# Altium schematic sheet Amoled.SchDoc: Mạch Amoled RP2040
size 420 x 297 mm; Author: Phuoc Do Tan; SheetNumber: 1; SheetTotal: 1
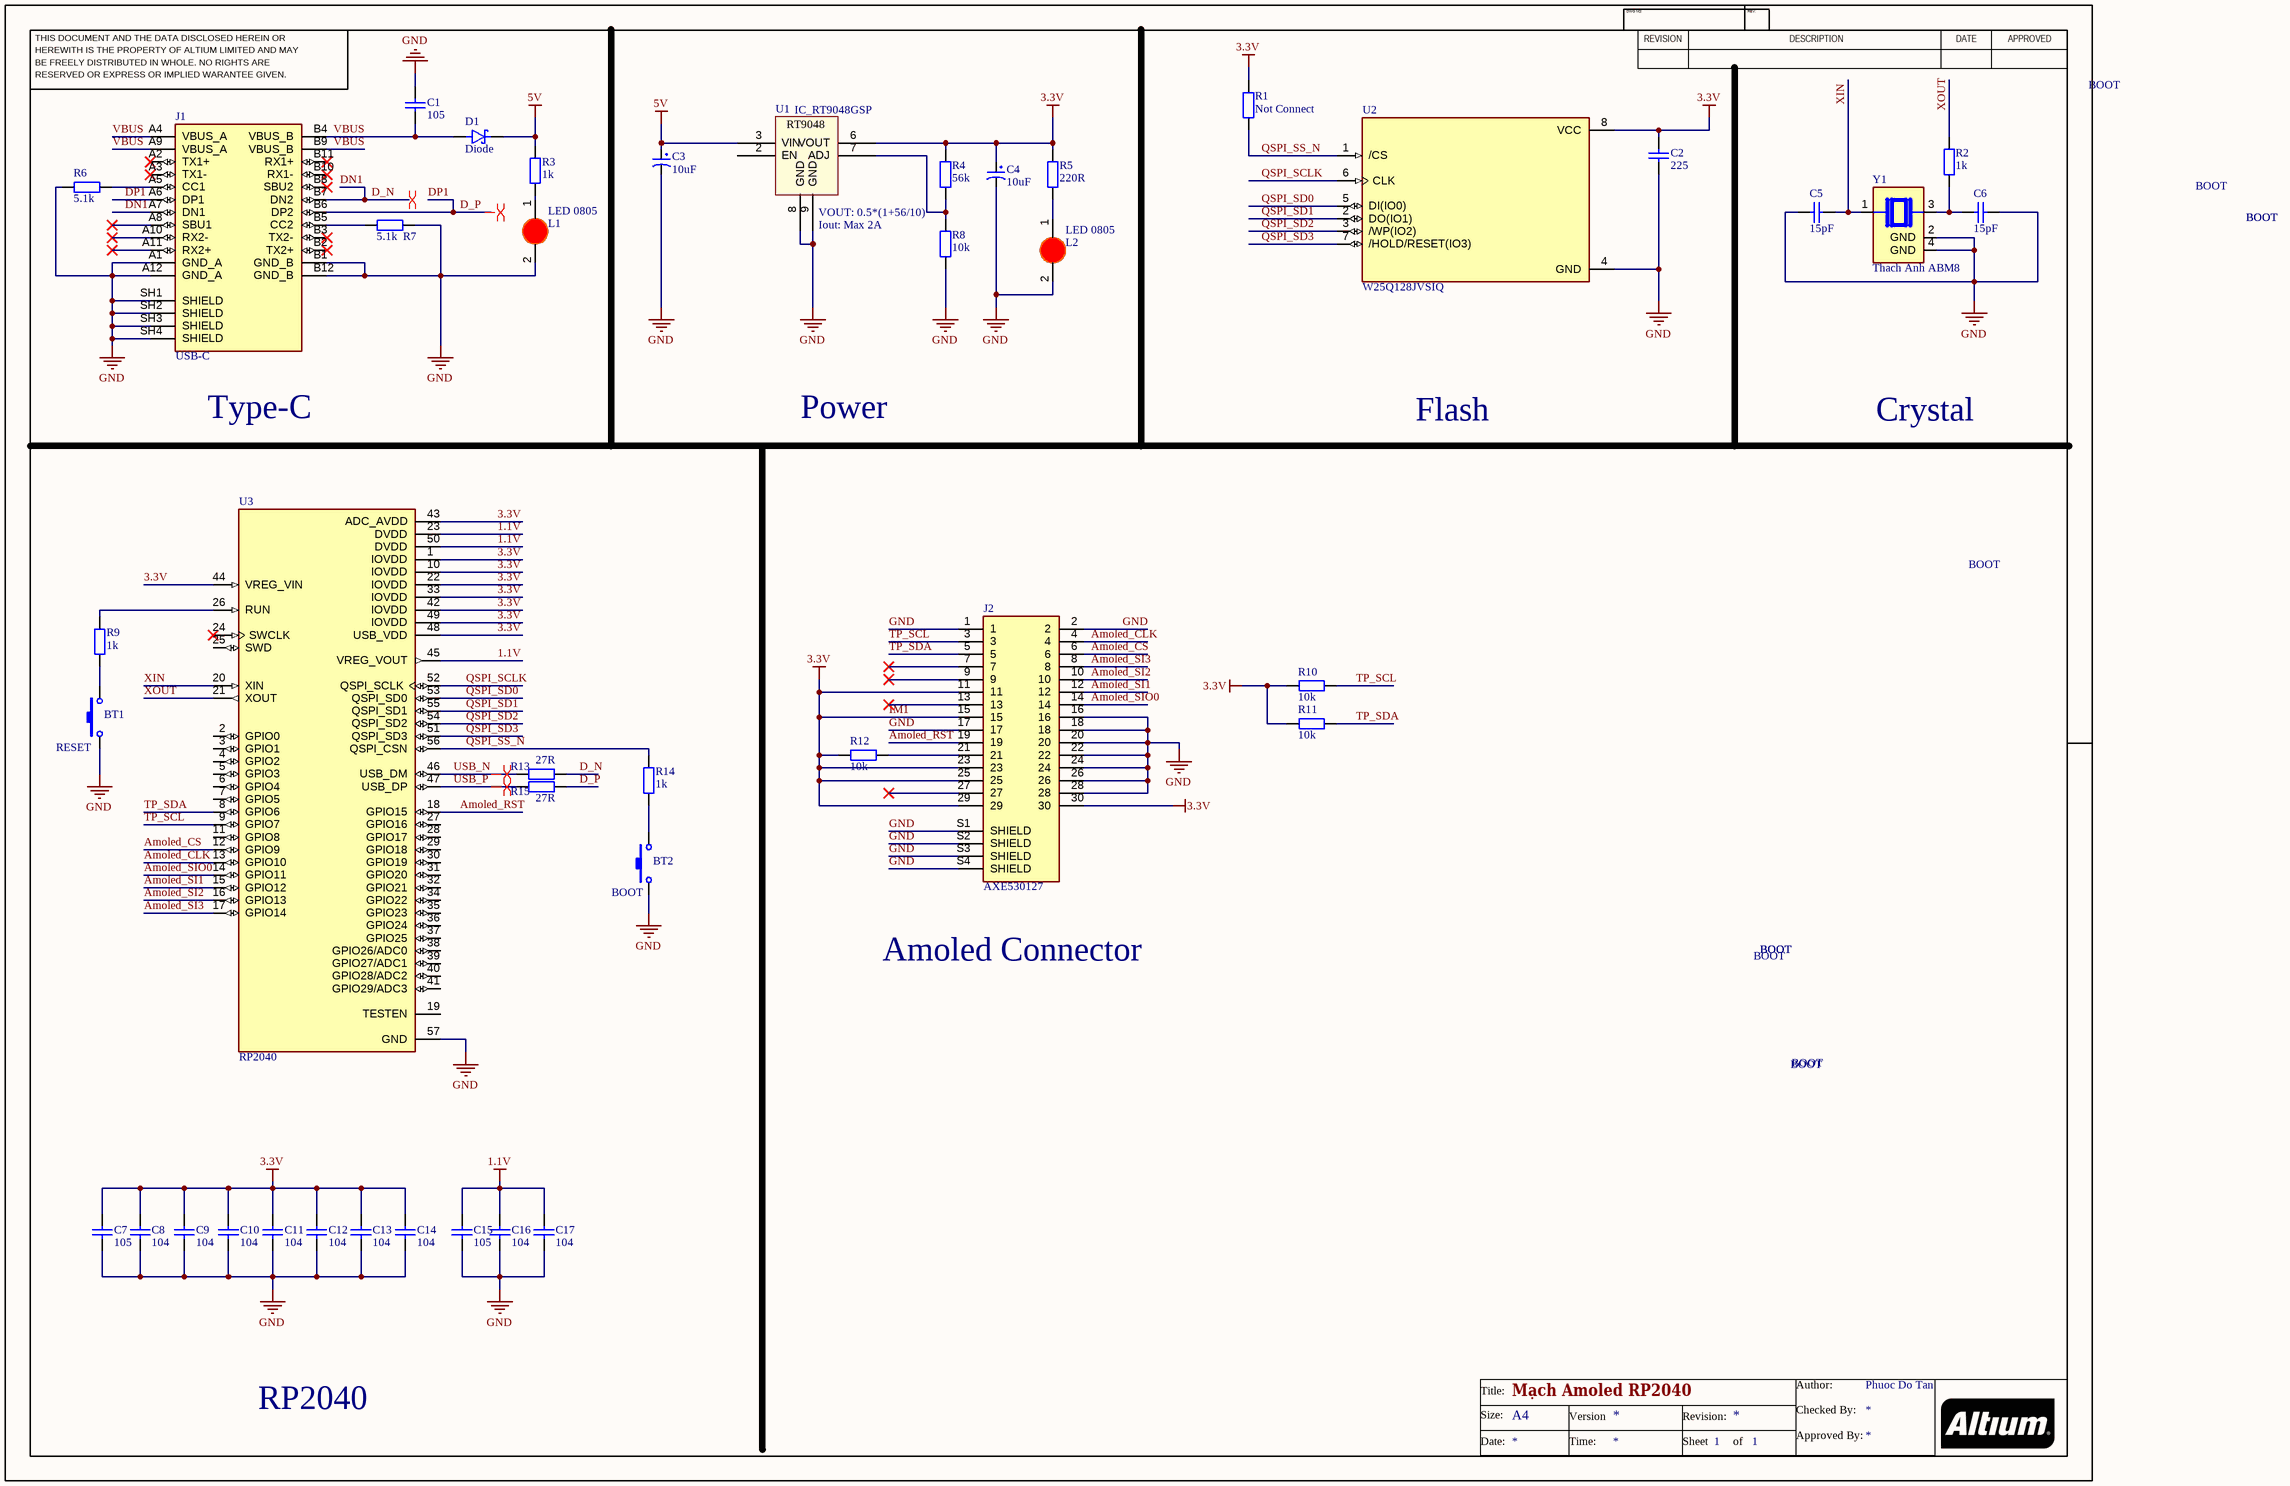
[diagram p0: Amoled.SchDoc]

## Parts
BT1  Nut Nhan 2 Chan SMD 3x6x2.5  [Nut Nhan 2 Chan SMD 3x6x2.5]  (value not drawn)
BT2  Nut Nhan 2 Chan SMD 3x6x2.5  [Nut Nhan 2 Chan SMD 3x6x2.5]  (value not drawn)
C1  105  [tu 0805]
C2  225  [tu 0805]
C3  10uF  [tu tantalum smd3216]
C4  10uF  [tu tantalum smd3216]
C5  15pF  [tu 0805]
C6  15pF  [tu 0805]
C7  105  [tu 0805]
C8  104  [tu 0805]
C9  104  [tu 0805]
C10  104  [tu 0805]
C11  104  [tu 0805]
C12  104  [tu 0805]
C13  104  [tu 0805]
C14  104  [tu 0805]
C15  105  [tu 0805]
C16  104  [tu 0805]
C17  104  [tu 0805]
D1  Diode  [SODFL3619X98N]
J1  USB-C  [USB-C]
J2  AXE530127  [PANASONIC_AXE530127]
L1  LED 0805  [LED-0805-Red]
L2  LED 0805  [LED-0805-Red]
R1  Not Connect  [tro smd 0805]
R2  1k  [tro smd 0805]
R3  1k  [tro smd 0805]
R4  56k  [tro smd 0805]
R5  220R  [tro smd 0805]
R6  5.1k  [tro smd 0805]
R7  5.1k  [tro smd 0805]
R8  10k  [tro smd 0805]
R9  1k  [tro smd 0805]
R10  10k  [tro smd 0805]
R11  10k  [tro smd 0805]
R12  10k  [tro smd 0805]
R13  27R  [tro smd 0805]
R14  1k  [tro smd 0805]
R15  27R  [tro smd 0805]
U1  IC_RT9048GSP  [SOP-8(Exposed Pad)]
U2  W25Q128JVSIQ  [SOIC127P790X216-8N]
U3  RP2040  [RP2040]
Y1  Thach Anh ABM8  [XTAL_ABM8-272-T3]

## Nets
1.1V: C15.1 C16.1 C17.1 U3.23(DVDD) U3.45(VREG_VOUT) U3.50(DVDD)
3.3V: C2.1 C4.1 C7.1 C8.1 C9.1 C10.1 C11.1 C12.1 C13.1 C14.1 J2.11 J2.15 J2.23 J2.25 J2.29 J2.30 R1.2 R4.2 R5.2 R10.1 R11.1 R12.1 U1.6(VOUT) U2.8(VCC) U3.1(IOVDD) U3.10(IOVDD) U3.22(IOVDD) U3.33(IOVDD) U3.42(IOVDD) U3.43(ADC_AVDD) U3.44(VREG_VIN) U3.48(USB_VDD) U3.49(IOVDD)  [also labelled IM1]
5V: C3.1 D1.K R3.1 U1.3(VIN)
GND: BT1.1 BT2.1 C1.1 C2.2 C3.2 C4.2 C5.2 C6.1 C7.2 C8.2 C9.2 C10.2 C11.2 C12.2 C13.2 C14.2 C15.2 C16.2 C17.2 J1.A1(GND_A) J1.A12(GND_A) J1.B1(GND_B) J1.B12(GND_B) J1.SH1(SHIELD) J1.SH2(SHIELD) J1.SH3(SHIELD) J1.SH4(SHIELD) J2.1 J2.2 J2.16 J2.17 J2.18 J2.20 J2.22 J2.24 J2.26 J2.28 J2.S1(SHIELD) J2.S2(SHIELD) J2.S3(SHIELD) J2.S4(SHIELD) L1.2(K) L2.2(K) R6.1 R7.2 R8.2 U1.8(GND) U1.9(GND) U2.4(GND) U3.57(GND) Y1.2(GND) Y1.4(GND)
Amoled_CLK: J2.4 U3.13(GPIO10)
Amoled_CS: J2.6 U3.12(GPIO9)
Amoled_RST: J2.19 U3.18(GPIO15)
Amoled_SI1: J2.12 U3.15(GPIO12)
Amoled_SI2: J2.10 U3.16(GPIO13)
Amoled_SI3: J2.8 U3.17(GPIO14)
Amoled_SIO0: J2.14 U3.14(GPIO11)
D_N: J1.A7(DN1) J1.B7(DN2) R13.2  [also labelled DN1]
D_P: J1.A6(DP1) J1.B6(DP2) R15.2  [also labelled DP1]
QSPI_SCLK: U2.6(CLK) U3.52(QSPI_SCLK)
QSPI_SD0: U2.5(DI(IO0)) U3.53(QSPI_SD0)
QSPI_SD1: U2.2(DO(IO1)) U3.55(QSPI_SD1)
QSPI_SD2: U2.3(/WP(IO2)) U3.54(QSPI_SD2)
QSPI_SD3: U2.7(/HOLD/RESET(IO3)) U3.51(QSPI_SD3)
QSPI_SS_N: R1.1 R14.1 U2.1(/CS) U3.56(QSPI_CSN)
TP_SCL: J2.3 R10.2 U3.9(GPIO7)
TP_SDA: J2.5 R11.2 U3.8(GPIO6)
USB_N: R13.1 U3.46(USB_DM)
USB_P: R15.1 U3.47(USB_DP)
VBUS: C1.2 D1.A J1.A4(VBUS_A) J1.A9(VBUS_A) J1.B4(VBUS_B) J1.B9(VBUS_B)
XIN: C5.1 U3.20(XIN) Y1.1
XOUT: R2.1 U3.21(XOUT)
NetBT1_2: BT1.2 R9.2
NetBT2_2: BT2.2 R14.2
NetC6_2: C6.2 R2.2 Y1.3
NetJ1_A5: J1.A5(CC1) R6.2
NetJ1_B5: J1.B5(CC2) R7.1
NetJ2_21: J2.21 R12.2
NetL1_1: L1.1(A) R3.2
NetL2_1: L2.1(A) R5.1
NetR4_1: R4.1 R8.1 U1.7(ADJ)
NetR9_1: R9.1 U3.26(RUN)

Not connected (* = marked no-connect by the designer): J1 A2(TX1+)* A3(TX1-)* A8(SBU1)* A10(RX2-)* A11(RX2+)* B2(TX2+)* B3(TX2-)* B8(SBU2)* B10(RX1-)* B11(RX1+)*; J2 7* 9* 13* 27*; U1 2(EN); U3 2(GPIO0) 3(GPIO1) 4(GPIO2) 5(GPIO3) 6(GPIO4) 7(GPIO5) 11(GPIO8) 19(TESTEN) 24(SWCLK)* 25(SWD) 27(GPIO16) 28(GPIO17) 29(GPIO18) 30(GPIO19) 31(GPIO20) 32(GPIO21) 34(GPIO22) 35(GPIO23) 36(GPIO24) 37(GPIO25) 38(GPIO26/ADC0) 39(GPIO27/ADC1) 40(GPIO28/ADC2) 41(GPIO29/ADC3)

## Layout directives
differential pair: D_N, D_P, USB_N, USB_P

## Notes on the sheet
- BOOT
- VOUT: 0.5*(1+56/10)
- (near U1) Iout: Max 2A
- Type-C
- Power
- Flash
- Crystal
- (near BT1) RESET
- (near BT2) BOOT
- Amoled Connector
- RP2040
- THIS DOCUMENT AND THE DATA DISCLOSED HEREIN OR
- HEREWITH IS THE PROPERTY OF ALTIUM LIMITED AND MAY
- DWG NO:
- REVISION
- REV:
- DESCRIPTION
- DATE
- APPROVED
- BE FREELY DISTRIBUTED IN WHOLE. NO RIGHTS ARE
- RESERVED OR EXPRESS OR IMPLIED WARANTEE GIVEN.
- Title:
- Size:
- Date:
- A4
- Version
- Time:
- Revision:
- Sheet
- of
- Checked By:
- Author:
- Approved By:
- (in symbol IC_RT9048GSP) RT9048

## Library data of the parts
BT1 BT2 = Nut Nhan 2 Chan SMD 3x6x2.5: Ma_Hang: MH001036; Ten: Nút Nhấn 2 Chân 3x6x2.5MM SMD
C1 C7 C15 = Tu 0805 105 50V 10%: Dán; Don_Vi: Con; So_Chan: 2; Ten_Linh_Kien: Tụ 0805 105-1uF 10% 50V; Ma_Hang: MH004552; Chung_Loai: Dán; Kieu_Chan: *
C2 = Tu 0805 225 25V 10%: Dán; Don_Vi: Con; So_Chan: 2; Ten_Linh_Kien: Tụ 0805 225-2.2uF 25V 10%; Ma_Hang: MH007483; Chung_Loai: Dán; Kieu_Chan: *
C3 C4 = Tu tantalum 10uF 16V SMD3216: Dán; Don_Vi: Con; So_Chan: 2; Ten_Linh_Kien: Tụ tantalum 106C-10uF 16V SMD3216; Ma_Hang: MH001954; Chung_Loai: Dán; Kieu_Chan: *
C5 C6 = Tu 0805 15pF 50V 10%: Dán; Don_Vi: Con; So_Chan: 2; Ten_Linh_Kien: Tụ 0805 15P 10% 50V; Ma_Hang: MH004556; Chung_Loai: Dán; Kieu_Chan: *
C8-C14 C16 C17 = Tu 0805 104 50V 10%: Dán; Don_Vi: Con; So_Chan: 2; Ten_Linh_Kien: Tụ 0805 104-100nF 10% 50V; Ma_Hang: MH004551; Chung_Loai: Dán; Kieu_Chan: *
D1 = Diode-MBR230LSFT1G: Diode Schottky 30 V 2A Surface Mount SOD-123FL; MF: ON Semiconductor; SnapEDA_Link: https://www.snapeda.com/parts/MBR230LSFT1G/Onsemi/view-part/?ref=snap; Package: SOD-123FL-2 ON Semiconductor; MP: MBR230LSFT1G; Check_prices: https://www.snapeda.com/parts/MBR230LSFT1G/Onsemi/view-part/?ref=eda
J1 = USB-C: Part Number: TE2345986-1; MP: 2345986-1; Package: None; Price: None; Value: *; Availability: Unavailable
J2 = AXE530127: 30 Position Connector Socket, Center Strip Contacts Surface Mount Gold; MF: Panasonic Electric Works; Purchase-URL: https://pricing.snapeda.com/search/part/AXE530127/?ref=eda; Package: None; MP: AXE530127; Value: *; SnapEDA_Link: https://www.snapeda.com/parts/AXE530127/Panasonic/view-part/?ref=snap; Availability: In Stock; Price: None; Check_prices: https://www.snapeda.com/parts/AXE530127/Panasonic/view-part/?ref=eda
L1 L2 = LED 0805 Do: Dán; Don_Vi: Con; Ma_Hang: MH000897; Ten_Linh_Kien: LED 0805 Màu Đỏ (Red); Ghi_Chu: *; Kieu_Chan: *; Chung_Loai: Dán
R1 = Tro 0805 5% 0R: Dán; Don_Vi: Con; So_Chan: 2; Ten_Linh_Kien: Trở 0805 5% 0R; Ma_Hang: MH005230; Chung_Loai: Dán; Kieu_Chan: *
R2 R3 R9 R14 = Tro 0805 5% 1k: Dán; Don_Vi: Con; So_Chan: 2; Ten_Linh_Kien: Trở 0805 5% 1k; Ma_Hang: MH005234; Chung_Loai: Dán; Kieu_Chan: *
R4 = Tro 0805 1% 510k: Dán; Don_Vi: Con; So_Chan: 2; Ten_Linh_Kien: Trở 0805 1% 56k; Ma_Hang: MH005486; Chung_Loai: Dán; Kieu_Chan: *
R5 = Tro 0805 5% 220R: Dán; Don_Vi: Con; So_Chan: 2; Ten_Linh_Kien: Trở 0805 5% 220R; Ma_Hang: MH005259; Chung_Loai: Dán; Kieu_Chan: *
R6 R7 = Tro 0805 1% 5.1k: Dán; Don_Vi: Con; So_Chan: 2; Ten_Linh_Kien: Trở 0805 1% 5.1k; Ma_Hang: MH008812; Chung_Loai: Dán; Kieu_Chan: *
R8 R10-R12 = Tro 0805 1% 10k: Dán; Don_Vi: Con; So_Chan: 2; Ten_Linh_Kien: Trở 0805 1% 10k; Ma_Hang: MH005473; Chung_Loai: Dán; Kieu_Chan: *
R13 R15 = Tro 0805 1% 18k: Dán; Don_Vi: Con; So_Chan: 2; Ten_Linh_Kien: Trở 0805 1% 27R; Ma_Hang: MH005477; Chung_Loai: Dán; Kieu_Chan: *
U2 = W25Q128JVSIQ: FLASH - NOR Memory IC 128Mb (16M x 8) SPI - Quad I/O, QPI, DTR 133 MHz 8-SOIC; MF: Winbond Electronics; SnapEDA_Link: https://www.snapeda.com/parts/W25Q128JVSIQ/Winbond/view-part/?ref=snap; Package: SOIC-8 Winbond Electronics; Value: *; MP: W25Q128JVSIQ; Check_prices: https://www.snapeda.com/parts/W25Q128JVSIQ/Winbond/view-part/?ref=eda
U3 = RP2040: RP2040 chip for Raspberry Pi Pico - ARM® Cortex®-M0+ MCU 32-Bit; SnapEDA_Link: https://www.snapeda.com/parts/RP2040/Raspberry+Pi/view-part/?ref=snap; Package: None; Value: *; MF: Raspberry Pi; MP: RP2040; Check_prices: https://www.snapeda.com/parts/RP2040/Raspberry+Pi/view-part/?ref=eda
Y1 = Thach Anh ABM8: 12 MHz Â±30ppm Crystal 10pF 50 Ohms 4-SMD, No Lead; MF: ABRACON; MP: ABM8-272-T3; SnapEDA_Link: https://www.snapeda.com/parts/ABM8-272-T3/Abracon/view-part/?ref=snap; Package: NON-STANDARD-4 Abracon; Value: *; Check_prices: https://www.snapeda.com/parts/ABM8-272-T3/Abracon/view-part/?ref=eda